# Altium schematic sheet Ampli_RF.SchDoc
size A4
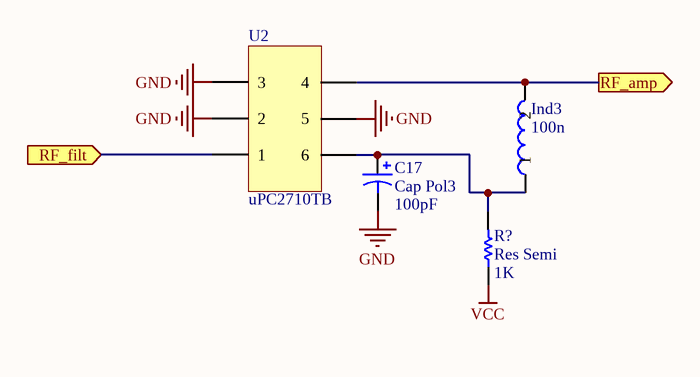
[diagram p0: Ampli_RF.SchDoc]

## Parts
C17  Cap Pol3  value 100pF  [C0805]
Ind3  Valor: 100n  [NTH12_2]  (hidden comment: Ind2)
R?  Res Semi  value 1K  [2012[0805]]
U2  uPC2710TB  [UPC2710TB2]

## Ports
RF_amp (out), RF_filt (in)

## Nets
GND: C17.2 U2.GND1(2) U2.GND2(3) U2.GND3(5)
VCC: R?.1
RF_amp: Ind3.2 U2.RF_OUT(4) ; port RF_amp
RF_filt: U2.RF_IN(1) ; port RF_filt
NetC17_1: C17.1 Ind3.1 R?.2 U2.Vcc(6)

## Library data of the parts
C17 = Cap Pol3: Polarized Capacitor (Surface Mount); Published: 8-Jun-2000; LatestRevisionDate: 17-Jul-2002; LatestRevisionNote: Re-released for DXP Platform.; PackageReference: C0805; Publisher: Altium Limited
R? = Res Semi: Semiconductor Resistor; Published: 8-Jun-2000; LatestRevisionDate: 17-Jul-2002; LatestRevisionNote: Re-released for DXP Platform.; PackageReference: AXIAL-0.5; Publisher: Altium Limited
U2 = uPC2710TB: pin to pad: GND1>2 GND2>3 GND3>5 RF_IN>1 RF_OUT>4 Vcc>6